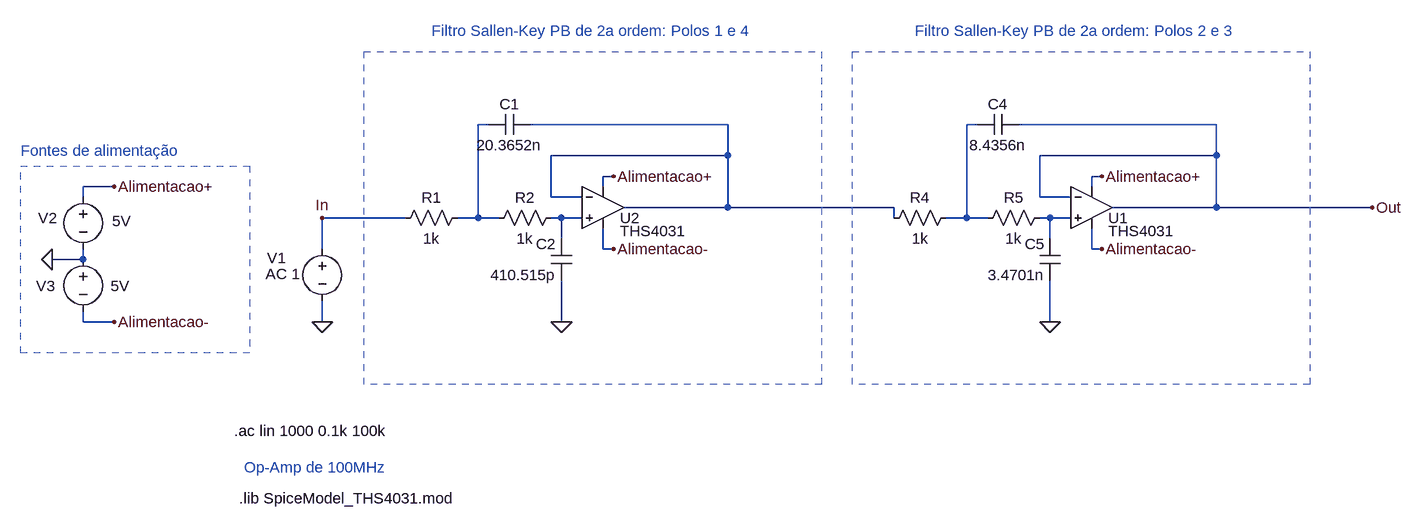
[diagram p0: schematic P3A06-Chebyshev_(LTspice).asc]
P3A06-Chebyshev_(LTspice).asc, the LTspice schematic file:
Version 4
SHEET 1 2508 680
WIRE 16 -96 0 -96
WIRE 384 -96 80 -96
WIRE 768 -96 752 -96
WIRE 1136 -96 832 -96
WIRE 384 -48 384 -96
WIRE 384 -48 112 -48
WIRE 1136 -48 1136 -96
WIRE 1136 -48 864 -48
WIRE 208 -16 192 -16
WIRE 960 -16 944 -16
WIRE -560 0 -608 0
WIRE 192 0 192 -16
WIRE 944 0 944 -16
WIRE -608 16 -608 0
WIRE 112 16 112 -48
WIRE 160 16 112 16
WIRE 864 16 864 -48
WIRE 912 16 864 16
WIRE 384 32 384 -48
WIRE 384 32 224 32
WIRE 640 32 384 32
WIRE 1136 32 1136 -48
WIRE 1136 32 976 32
WIRE 1376 32 1136 32
WIRE -112 48 -240 48
WIRE 0 48 0 -96
WIRE 0 48 -32 48
WIRE 32 48 0 48
WIRE 128 48 112 48
WIRE 160 48 128 48
WIRE 640 48 640 32
WIRE 752 48 752 -96
WIRE 752 48 720 48
WIRE 784 48 752 48
WIRE 880 48 864 48
WIRE 912 48 880 48
WIRE 128 80 128 48
WIRE 880 80 880 48
WIRE -240 96 -240 48
WIRE 192 96 192 64
WIRE 208 96 192 96
WIRE 944 96 944 64
WIRE 960 96 944 96
WIRE -608 112 -608 96
WIRE -608 112 -656 112
WIRE -608 208 -608 192
WIRE -560 208 -608 208
WIRE -240 208 -240 176
WIRE 128 208 128 144
WIRE 880 208 880 144
FLAG -240 208 0
FLAG -656 112 0
FLAG -560 0 Alimentacao+
FLAG -560 208 Alimentacao-
FLAG 208 -16 Alimentacao+
FLAG 208 96 Alimentacao-
FLAG 128 208 0
FLAG -240 48 In
FLAG 960 -16 Alimentacao+
FLAG 960 96 Alimentacao-
FLAG 880 208 0
FLAG 1376 32 Out
SYMBOL voltage -240 80 R0
WINDOW 123 -87 54 Left 2
WINDOW 39 0 0 Left 0
WINDOW 0 -85 30 Left 2
WINDOW 3 -150 216 Left 2
SYMATTR Value2 AC 1
SYMATTR InstName V1
SYMATTR Value ""
SYMBOL res -16 32 R90
WINDOW 0 0 56 VBottom 2
WINDOW 3 32 56 VTop 2
SYMATTR InstName R1
SYMATTR Value 1k
SYMBOL voltage -608 0 R0
WINDOW 123 0 0 Left 0
WINDOW 39 0 0 Left 0
WINDOW 0 -69 48 Left 2
WINDOW 3 45 53 Left 2
SYMATTR InstName V2
SYMATTR Value 5V
SYMBOL voltage -608 96 R0
WINDOW 123 0 0 Left 0
WINDOW 39 0 0 Left 0
WINDOW 0 -72 57 Left 2
WINDOW 3 42 57 Left 2
SYMATTR InstName V3
SYMATTR Value 5V
SYMBOL cap 80 -112 R90
WINDOW 0 0 32 VBottom 2
WINDOW 3 32 32 VTop 2
SYMATTR InstName C1
SYMATTR Value 20.3652n
SYMBOL Opamps\\opamp2 192 -32 R0
WINDOW 0 26 80 Left 2
WINDOW 3 26 100 Left 2
SYMATTR InstName U2
SYMATTR Value THS4031
SYMBOL res 128 32 R90
WINDOW 0 0 56 VBottom 2
WINDOW 3 32 56 VTop 2
SYMATTR InstName R2
SYMATTR Value 1k
SYMBOL cap 144 144 R180
WINDOW 0 24 56 Left 2
WINDOW 3 24 8 Left 2
SYMATTR InstName C2
SYMATTR Value 410.515p
SYMBOL res 736 32 R90
WINDOW 0 0 56 VBottom 2
WINDOW 3 32 56 VTop 2
SYMATTR InstName R4
SYMATTR Value 1k
SYMBOL cap 832 -112 R90
WINDOW 0 0 32 VBottom 2
WINDOW 3 32 32 VTop 2
SYMATTR InstName C4
SYMATTR Value 8.4356n
SYMBOL Opamps\\opamp2 944 -32 R0
WINDOW 0 26 80 Left 2
WINDOW 3 26 100 Left 2
SYMATTR InstName U1
SYMATTR Value THS4031
SYMBOL res 880 32 R90
WINDOW 0 0 56 VBottom 2
WINDOW 3 32 56 VTop 2
SYMATTR InstName R5
SYMATTR Value 1k
SYMBOL cap 896 144 R180
WINDOW 0 24 56 Left 2
WINDOW 3 24 8 Left 2
SYMATTR InstName C5
SYMATTR Value 3.4701n
TEXT -704 -56 Left 2 ;Fontes de alimentação
TEXT -72 -240 Left 2 ;Filtro Sallen-Key PB de 2a ordem: Polos 1 e 4
TEXT -376 376 Left 2 !.ac lin 1000 0.1k 100k
TEXT -368 480 Left 2 !.lib SpiceModel_THS4031.mod
TEXT -360 432 Left 2 ;Op-Amp de 100MHz
TEXT 672 -240 Left 2 ;Filtro Sallen-Key PB de 2a ordem: Polos 2 e 3
RECTANGLE Normal -352 256 -704 -32 2
RECTANGLE Normal 528 304 -176 -208 2
RECTANGLE Normal 1280 304 576 -208 2

The netlist it stands for:
* P3A06-Chebyshev_(LTspice).asc
V1 In 0 AC 1
R1 N001 In 1k
V2 Alimentacao+ 0 5V
V3 0 Alimentacao- 5V
C1 N002 N001 20.3652n
XU2 N004 N002 Alimentacao+ Alimentacao- N002 THS4031  ; pins In+ In- V+ V- OUT
R2 N004 N001 1k
C2 0 N004 410.515p
R4 N003 N002 1k
C4 Out N003 8.4356n
XU1 N005 Out Alimentacao+ Alimentacao- Out THS4031  ; pins In+ In- V+ V- OUT
R5 N005 N003 1k
C5 0 N005 3.4701n
* Fontes de alimentação
* Filtro Sallen-Key PB de 2a ordem: Polos 1 e 4
.ac lin 1000 0.1k 100k
.lib SpiceModel_THS4031.mod
* Op-Amp de 100MHz
* Filtro Sallen-Key PB de 2a ordem: Polos 2 e 3
.backanno
.end